# Altium schematic sheet Debug_UART.SchDoc
size A4; PageSetup: Record=PageOptions|CenterHorizontal=True|CenterVertical=True|PrintScale=1.00|XCorrection=1.00|YCorrection=1.00|PrintKind=0|BorderSize=5000000|LeftOffset=0|BottomOffset=0|Orientation=2|PaperLength=1000|PaperWidth=1000|Scale=100|PaperSource=7|PrintQuality=-3|MediaType=1|DitherType=10|PrintScaleMode=1|PaperKind=A4|PaperIndex=9
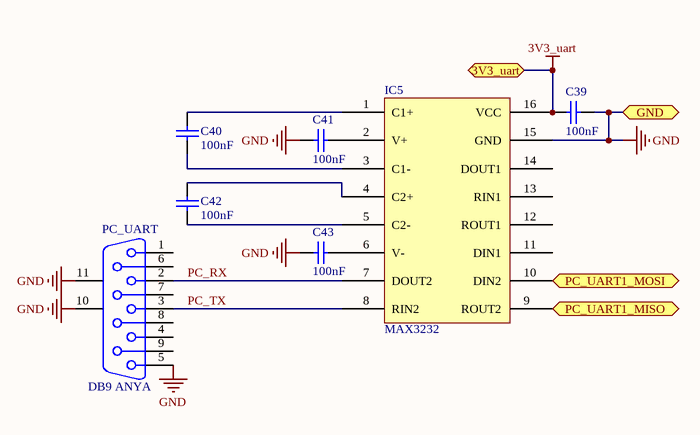
[diagram p0: Debug_UART.SchDoc]

## Parts
C39  value 100nF  [FP_0603_CAP_080]  (hidden comment: Cap)
C40  value 100nF  [FP_0603_CAP_080]  (hidden comment: Cap)
C41  value 100nF  [FP_0603_CAP_080]  (hidden comment: Cap)
C42  value 100nF  [FP_0603_CAP_080]  (hidden comment: Cap)
C43  value 100nF  [FP_0603_CAP_080]  (hidden comment: Cap)
IC5  MAX3232  [SOIC16]
PC_UART  DB9 ANYA  [DB9_connector]

## Ports
3V3_uart, GND, PC_UART1_MISO (out), PC_UART1_MOSI (in)

## Nets
3V3_uart: C39.2 IC5.16(VCC) ; port 3V3_uart
GND: C39.1 C41.1 C43.1 IC5.15(GND) PC_UART.5 PC_UART.10(MH1) PC_UART.11(MH2) ; port GND
PC_RX: IC5.7(DOUT2) PC_UART.2
PC_TX: IC5.8(RIN2) PC_UART.3
PC_UART1_MISO: IC5.9(ROUT2) ; port PC_UART1_MISO
PC_UART1_MOSI: IC5.10(DIN2) ; port PC_UART1_MOSI
NetC40_1: C40.1 IC5.3(C1-)
NetC40_2: C40.2 IC5.1(C1+)
NetC41_2: C41.2 IC5.2(V+)
NetC42_1: C42.1 IC5.5(C2-)
NetC42_2: C42.2 IC5.4(C2+)
NetC43_2: C43.2 IC5.6(V-)

Not connected (* = marked no-connect by the designer): IC5 11(DIN1) 12(ROUT1) 13(RIN1) 14(DOUT1); PC_UART 1 4 6 7 8 9

## Library data of the parts
C39-C43 = Cap: Capacitor; Published: 8-Jun-2000; LatestRevisionDate: 17-Jul-2002; LatestRevisionNote: Re-released for DXP Platform.; PackageReference: RAD-0.3; Publisher: Altium Limited; PackageDescription: Radial Cap, Thru-Hole; 2 Leads; 0.3 in Pin Spacing
PC_UART = D Connector 9: Receptacle Assembly, 9 Position, Right Angle; PackageDocument: O; Positions: 9; Published: 15-Jun-2001; LatestRevisionDate: 17-Jul-2002; LatestRevisionNote: Re-released for DXP Platform.; DatasheetDocument: 1-Sep-1999; PackageReference: 788750; Publisher: Altium Limited; Orientation: Right Angle; Gender: Receptacle